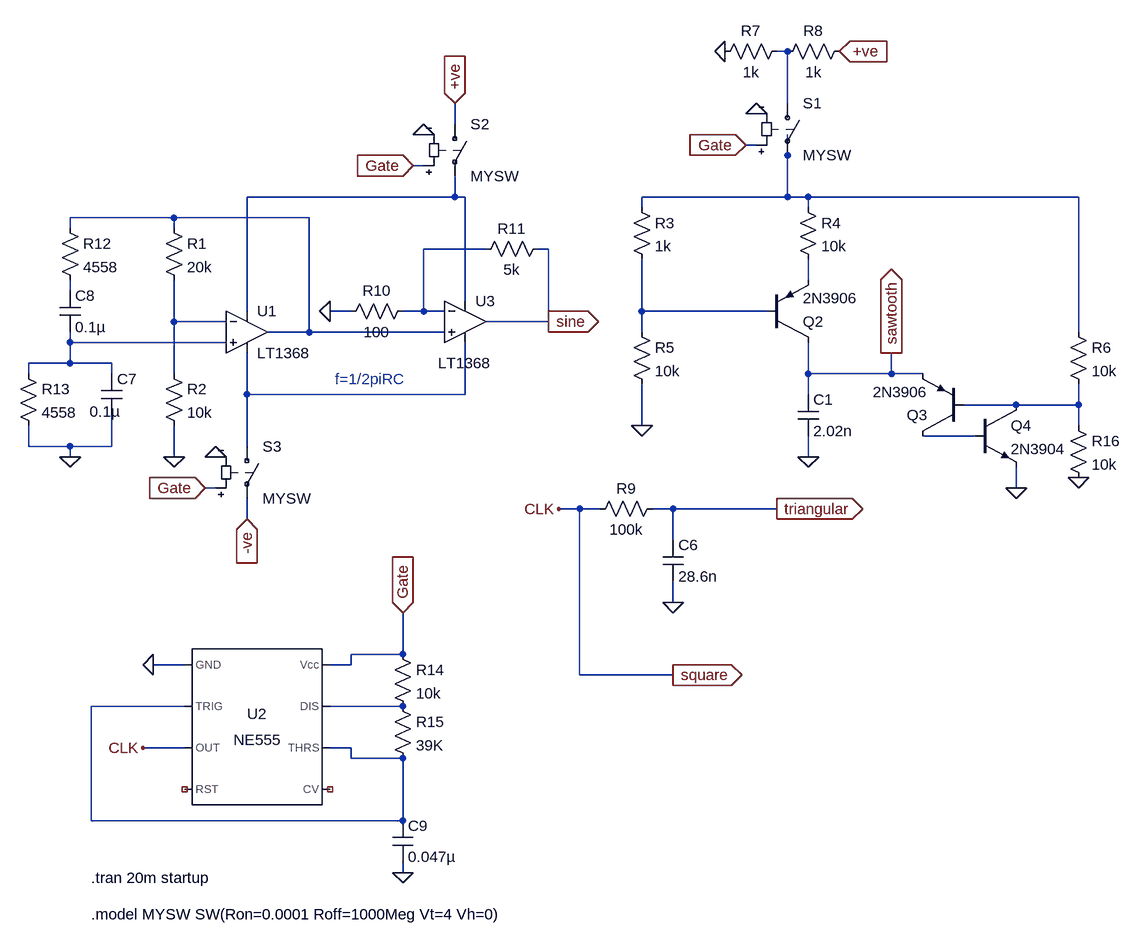
[diagram p0: schematic fa.asc]
fa.asc, the LTspice schematic file:
Version 4
SHEET 1 2532 1088
WIRE 624 -256 608 -256
WIRE 624 -176 624 -256
WIRE 112 -144 112 -176
WIRE 576 -112 560 -112
WIRE 624 -96 624 -128
WIRE 64 -80 48 -80
WIRE 112 -32 112 -64
WIRE 112 -32 -208 -32
WIRE 128 -32 112 -32
WIRE 624 -32 624 -96
WIRE 624 -32 400 -32
WIRE 656 -32 624 -32
WIRE 1072 -32 656 -32
WIRE 400 -16 400 -32
WIRE 656 -16 656 -32
WIRE -320 0 -480 0
WIRE -112 0 -320 0
WIRE -480 16 -480 0
WIRE -320 16 -320 0
WIRE 160 48 64 48
WIRE 256 48 240 48
WIRE 656 96 656 64
WIRE -480 112 -480 96
WIRE 128 128 128 -32
WIRE -208 144 -208 -32
WIRE -48 144 -80 144
WIRE 64 144 64 48
WIRE 64 144 32 144
WIRE 96 144 64 144
WIRE 400 144 400 64
WIRE 592 144 400 144
WIRE -320 160 -320 96
WIRE -240 160 -320 160
WIRE 256 160 256 48
WIRE 256 160 160 160
WIRE -112 176 -112 0
WIRE -112 176 -176 176
WIRE 96 176 -112 176
WIRE 400 176 400 144
WIRE 1072 176 1072 -32
WIRE -480 192 -480 176
WIRE -240 192 -480 192
WIRE -480 224 -480 192
WIRE -480 224 -544 224
WIRE -416 224 -480 224
WIRE -544 240 -544 224
WIRE -416 240 -416 224
WIRE -320 240 -320 160
WIRE 656 240 656 192
WIRE 784 240 784 208
WIRE 784 240 656 240
WIRE 832 240 784 240
WIRE -208 272 -208 208
WIRE 128 272 128 192
WIRE 128 272 -208 272
WIRE 656 272 656 240
WIRE 976 288 896 288
WIRE 1072 288 1072 256
WIRE 1072 288 976 288
WIRE 400 320 400 256
WIRE 1072 320 1072 288
WIRE 912 336 832 336
WIRE -544 352 -544 320
WIRE -480 352 -544 352
WIRE -416 352 -416 304
WIRE -416 352 -480 352
WIRE -208 352 -208 272
WIRE -480 368 -480 352
WIRE -320 368 -320 320
WIRE 656 368 656 336
WIRE -256 416 -272 416
WIRE 976 416 976 384
WIRE 304 448 272 448
WIRE 336 448 304 448
WIRE 448 448 416 448
WIRE 608 448 448 448
WIRE -208 464 -208 432
WIRE 448 496 448 448
WIRE 448 592 448 560
WIRE 32 672 32 608
WIRE 32 672 -48 672
WIRE -304 688 -352 688
WIRE -48 688 -48 672
WIRE -48 688 -80 688
WIRE 304 704 304 448
WIRE 448 704 304 704
WIRE -304 752 -448 752
WIRE 32 752 -80 752
WIRE -304 816 -368 816
WIRE -48 816 -80 816
WIRE -48 832 -48 816
WIRE 32 832 -48 832
WIRE -448 928 -448 752
WIRE 32 928 32 832
WIRE 32 928 -448 928
WIRE 32 1008 32 992
FLAG -320 368 0
FLAG -208 464 -ve
IOPIN -208 464 In
FLAG 256 160 sine
IOPIN 256 160 Out
FLAG -368 816 CLK
FLAG -352 688 0
FLAG 272 448 CLK
FLAG 448 592 0
FLAG 448 704 square
IOPIN 448 704 Out
FLAG 608 448 triangular
IOPIN 608 448 Out
FLAG -80 144 0
FLAG -480 368 0
FLAG 32 608 Gate
IOPIN 32 608 In
FLAG 32 1008 0
FLAG 656 368 0
FLAG 400 320 0
FLAG 976 416 0
FLAG 1072 400 0
FLAG 784 208 sawtooth
IOPIN 784 208 Out
FLAG 704 -256 +ve
IOPIN 704 -256 In
FLAG 528 -256 0
FLAG 576 -160 0
FLAG 560 -112 Gate
IOPIN 560 -112 In
FLAG 112 -176 +ve
IOPIN 112 -176 In
FLAG 64 -128 0
FLAG 48 -80 Gate
IOPIN 48 -80 In
FLAG -256 368 0
FLAG -272 416 Gate
IOPIN -272 416 In
SYMBOL res -336 0 R0
SYMATTR InstName R1
SYMATTR Value 20k
SYMBOL res -336 224 R0
SYMATTR InstName R2
SYMATTR Value 10k
SYMBOL Opamps\\LT1368 -208 112 R0
SYMATTR InstName U1
SYMBOL Misc\\NE555 -192 784 R0
SYMATTR InstName U2
SYMBOL res 432 432 R90
WINDOW 0 0 56 VBottom 2
WINDOW 3 32 56 VTop 2
SYMATTR InstName R9
SYMATTR Value 100k
SYMBOL cap 432 496 R0
SYMATTR InstName C6
SYMATTR Value 28.6n
SYMBOL Opamps\\LT1368 128 96 R0
WINDOW 3 -42 128 Left 2
SYMATTR InstName U3
SYMBOL res 48 128 R90
WINDOW 0 0 56 VBottom 2
WINDOW 3 32 56 VTop 2
SYMATTR InstName R10
SYMATTR Value 100
SYMBOL res 256 32 R90
WINDOW 0 0 56 VBottom 2
WINDOW 3 32 56 VTop 2
SYMATTR InstName R11
SYMATTR Value 5k
SYMBOL cap -432 240 R0
WINDOW 3 -18 58 Left 2
SYMATTR Value 0.1µ
SYMATTR InstName C7
SYMBOL cap -496 112 R0
SYMATTR InstName C8
SYMATTR Value 0.1µ
SYMBOL res -496 0 R0
SYMATTR InstName R12
SYMATTR Value 4558
SYMBOL res -560 224 R0
SYMATTR InstName R13
SYMATTR Value 4558
SYMBOL res 16 656 R0
SYMATTR InstName R14
SYMATTR Value 10k
SYMBOL res 16 736 R0
SYMATTR InstName R15
SYMATTR Value 39K
SYMBOL cap 16 928 R0
SYMATTR InstName C9
SYMATTR Value 0.047µ
SYMBOL res 384 -32 R0
SYMATTR InstName R3
SYMATTR Value 1k
SYMBOL res 640 -32 R0
SYMATTR InstName R4
SYMATTR Value 10k
SYMBOL pnp 592 192 M180
SYMATTR InstName Q2
SYMATTR Value 2N3906
SYMBOL res 384 160 R0
SYMATTR InstName R5
SYMATTR Value 10k
SYMBOL pnp 896 336 R180
SYMATTR InstName Q3
SYMATTR Value 2N3906
SYMBOL cap 640 272 R0
SYMATTR InstName C1
SYMATTR Value 2.02n
SYMBOL npn 912 288 R0
SYMATTR InstName Q4
SYMATTR Value 2N3904
SYMBOL res 1056 160 R0
SYMATTR InstName R6
SYMATTR Value 10k
SYMBOL res 1056 304 R0
SYMATTR InstName R16
SYMATTR Value 10k
SYMBOL res 624 -272 R90
WINDOW 0 0 56 VBottom 2
WINDOW 3 32 56 VTop 2
SYMATTR InstName R7
SYMATTR Value 1k
SYMBOL res 720 -272 R90
WINDOW 0 0 56 VBottom 2
WINDOW 3 32 56 VTop 2
SYMATTR InstName R8
SYMATTR Value 1k
SYMBOL sw 624 -192 R0
SYMATTR InstName S1
SYMATTR Value MYSW
SYMBOL sw 112 -160 R0
SYMATTR InstName S2
SYMATTR Value MYSW
SYMBOL sw -208 336 R0
SYMATTR InstName S3
SYMATTR Value MYSW
TEXT -72 248 Left 2 ;f=1/2piRC
TEXT -448 1016 Left 2 !.tran 20m startup
TEXT -448 1072 Left 2 !.model MYSW SW(Ron=0.0001 Roff=1000Meg Vt=4 Vh=0)

The netlist it stands for:
* fa.asc
R1 N004 N009 20k
R2 N009 0 10k
XU1 N010 N009 N003 N011 N004 LT1368  ; pins In+ In- V+ V- OUT
XU2 0 N014 square NC_01 NC_02 N014 N015 Gate NE555  ; pins GND TRIG OUT RST CV THRS DIS Vcc
R9 triangular square 100k
C6 triangular 0 28.6n
XU3 N004 N005 N003 N011 sine LT1368  ; pins In+ In- V+ V- OUT
R10 N005 0 100
R11 sine N005 5k
C7 N010 0 0.1µ
C8 N007 N010 0.1µ
R12 N004 N007 4558
R13 N010 0 4558
R14 Gate N015 10k
R15 N015 N014 39K
C9 N014 0 0.047µ
R3 N002 N008 1k
R4 N002 N006 10k
Q2 sawtooth N008 N006 0 2N3906
R5 N008 0 10k
Q3 N013 N012 sawtooth 0 2N3906
C1 sawtooth 0 2.02n
Q4 N012 N013 0 0 2N3904
R6 N002 N012 10k
R16 N012 0 10k
R7 N001 0 1k
R8 +ve N001 1k
S1 N001 N002 Gate 0 MYSW
S2 +ve N003 Gate 0 MYSW
S3 N011 -ve Gate 0 MYSW
.model NPN NPN
.model PNP PNP
.lib standard.bjt
* f=1/2piRC
.tran 20m startup
.model MYSW SW(Ron=0.0001 Roff=1000Meg Vt=4 Vh=0)
.lib NE555.sub
.backanno
.end